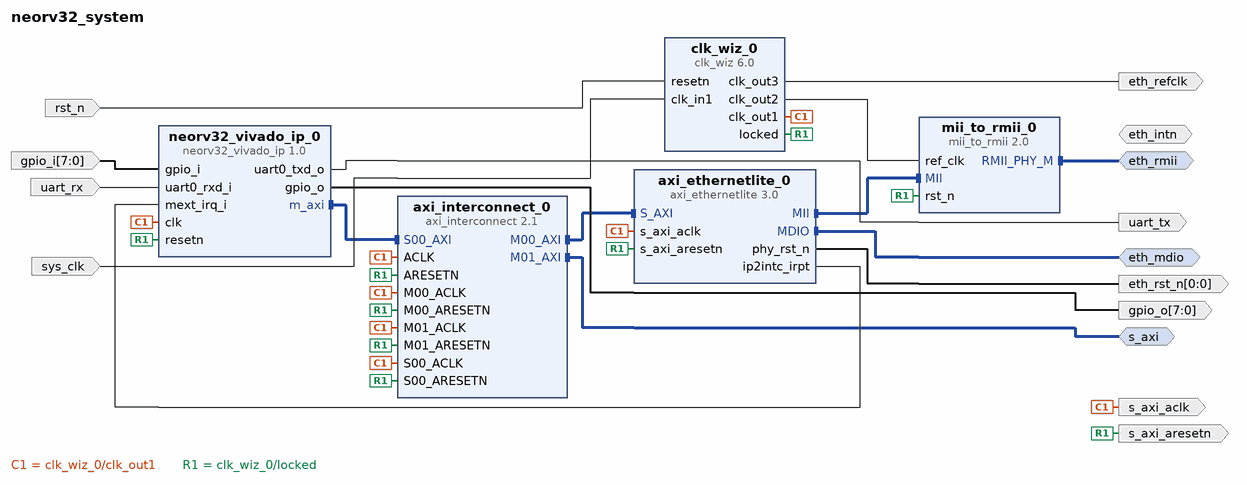
[diagram p0: block diagram of the top level]
# Vivado block design neorv32_system, xc7a100tcsg324-1, Vivado 2024.1
create_bd_design neorv32_system

create_bd_intf_port -mode Master -vlnv xilinx.com:interface:mdio_rtl:1.0 eth_mdio
create_bd_intf_port -mode Master -vlnv xilinx.com:interface:rmii_rtl:1.0 eth_rmii
create_bd_intf_port -mode Master -vlnv xilinx.com:interface:aximm_rtl:1.0 s_axi
set_property -dict [list \
  CONFIG.ADDR_WIDTH 32 \
  CONFIG.DATA_WIDTH 32 \
  CONFIG.HAS_BURST 0 \
  CONFIG.HAS_CACHE 0 \
  CONFIG.HAS_LOCK 0 \
  CONFIG.HAS_QOS 0 \
  CONFIG.HAS_REGION 0 \
  CONFIG.PROTOCOL AXI4LITE \
] [get_bd_intf_ports s_axi]
create_bd_port -dir I -type clk sys_clk
set_property -dict {CONFIG.FREQ_HZ 100000000} [get_bd_ports sys_clk]
create_bd_port -dir I -type rst rst_n
create_bd_port -dir I -from 7 -to 0 gpio_i
create_bd_port -dir O -from 7 -to 0 gpio_o
create_bd_port -dir I uart_rx
create_bd_port -dir O uart_tx
create_bd_port -dir O -from 0 -to 0 eth_rst_n
create_bd_port -dir O -type clk eth_refclk
create_bd_port -dir IO eth_intn
create_bd_port -dir O s_axi_aresetn
create_bd_port -dir O -type clk s_axi_aclk
set_property -dict {CONFIG.ASSOCIATED_BUSIF s_axi} [get_bd_ports s_axi_aclk]

create_bd_cell -type ip -vlnv NEORV32:user:neorv32_vivado_ip:1.0 neorv32_vivado_ip_0
set_property -dict [list \
  CONFIG.IO_CLINT_EN true \
  CONFIG.IO_GPIO_EN true \
  CONFIG.IO_GPIO_IN_NUM 8 \
  CONFIG.IO_GPIO_OUT_NUM 8 \
  CONFIG.IO_UART0_EN true \
  CONFIG.IO_UART0_RX_FIFO 64 \
  CONFIG.IO_UART0_TX_FIFO 64 \
  CONFIG.MEM_INT_DMEM_EN true \
  CONFIG.MEM_INT_DMEM_SIZE 65536 \
  CONFIG.MEM_INT_IMEM_EN true \
  CONFIG.MEM_INT_IMEM_SIZE 65536 \
  CONFIG.OCD_EN false \
  CONFIG.RISCV_ISA_C true \
  CONFIG.RISCV_ISA_E false \
  CONFIG.RISCV_ISA_M true \
  CONFIG.RISCV_ISA_Zaamo true \
  CONFIG.RISCV_ISA_Zalrsc true \
  CONFIG.RISCV_ISA_Zicntr true \
  CONFIG.XBUS_EN true \
  CONFIG.XBUS_REGSTAGE_EN false \
] [get_bd_cells neorv32_vivado_ip_0]
create_bd_cell -type ip -vlnv xilinx.com:ip:clk_wiz:6.0 clk_wiz_0
set_property -dict [list \
  CONFIG.CLKOUT2_JITTER 151.636 \
  CONFIG.CLKOUT2_PHASE_ERROR 98.575 \
  CONFIG.CLKOUT2_REQUESTED_OUT_FREQ 50.000 \
  CONFIG.CLKOUT2_USED true \
  CONFIG.CLKOUT3_JITTER 151.636 \
  CONFIG.CLKOUT3_PHASE_ERROR 98.575 \
  CONFIG.CLKOUT3_REQUESTED_OUT_FREQ 50 \
  CONFIG.CLKOUT3_REQUESTED_PHASE 45 \
  CONFIG.CLKOUT3_USED true \
  CONFIG.MMCM_CLKOUT1_DIVIDE 20 \
  CONFIG.MMCM_CLKOUT2_DIVIDE 20 \
  CONFIG.MMCM_CLKOUT2_PHASE 45.000 \
  CONFIG.NUM_OUT_CLKS 3 \
  CONFIG.RESET_PORT resetn \
  CONFIG.RESET_TYPE ACTIVE_LOW \
  CONFIG.USE_DYN_PHASE_SHIFT false \
] [get_bd_cells clk_wiz_0]
create_bd_cell -type ip -vlnv xilinx.com:ip:axi_ethernetlite:3.0 axi_ethernetlite_0
set_property -dict [list \
  CONFIG.C_INCLUDE_GLOBAL_BUFFERS 1 \
  CONFIG.C_INCLUDE_INTERNAL_LOOPBACK 0 \
  CONFIG.C_INCLUDE_MDIO 1 \
  CONFIG.C_RX_PING_PONG 0 \
  CONFIG.C_TX_PING_PONG 0 \
] [get_bd_cells axi_ethernetlite_0]
create_bd_cell -type ip -vlnv xilinx.com:ip:mii_to_rmii:2.0 mii_to_rmii_0
create_bd_cell -type ip -vlnv xilinx.com:ip:axi_interconnect:2.1 axi_interconnect_0

# ---- connections ----

connect_bd_intf_net [get_bd_intf_ports eth_mdio] [get_bd_intf_pins axi_ethernetlite_0/MDIO]
connect_bd_intf_net [get_bd_intf_pins axi_ethernetlite_0/MII] [get_bd_intf_pins mii_to_rmii_0/MII]
connect_bd_intf_net [get_bd_intf_pins axi_ethernetlite_0/S_AXI] [get_bd_intf_pins axi_interconnect_0/M00_AXI]
connect_bd_intf_net [get_bd_intf_ports s_axi] [get_bd_intf_pins axi_interconnect_0/M01_AXI]
connect_bd_intf_net [get_bd_intf_ports eth_rmii] [get_bd_intf_pins mii_to_rmii_0/RMII_PHY_M]
connect_bd_intf_net [get_bd_intf_pins neorv32_vivado_ip_0/m_axi] [get_bd_intf_pins axi_interconnect_0/S00_AXI]
connect_bd_net [get_bd_pins axi_ethernetlite_0/ip2intc_irpt] [get_bd_pins neorv32_vivado_ip_0/mext_irq_i]
connect_bd_net [get_bd_pins axi_ethernetlite_0/phy_rst_n] [get_bd_ports eth_rst_n]
connect_bd_net [get_bd_pins clk_wiz_0/clk_out1] \
  [get_bd_pins axi_ethernetlite_0/s_axi_aclk] [get_bd_pins neorv32_vivado_ip_0/clk] [get_bd_pins axi_interconnect_0/ACLK] \
  [get_bd_pins axi_interconnect_0/M00_ACLK] [get_bd_pins axi_interconnect_0/M01_ACLK] \
  [get_bd_pins axi_interconnect_0/S00_ACLK] [get_bd_ports s_axi_aclk]
connect_bd_net [get_bd_pins clk_wiz_0/clk_out2] [get_bd_pins mii_to_rmii_0/ref_clk]
connect_bd_net [get_bd_pins clk_wiz_0/clk_out3] [get_bd_ports eth_refclk]
connect_bd_net [get_bd_pins clk_wiz_0/locked] \
  [get_bd_pins axi_ethernetlite_0/s_axi_aresetn] [get_bd_pins neorv32_vivado_ip_0/resetn] \
  [get_bd_pins axi_interconnect_0/M01_ARESETN] [get_bd_pins axi_interconnect_0/M00_ARESETN] \
  [get_bd_pins axi_interconnect_0/S00_ARESETN] [get_bd_pins axi_interconnect_0/ARESETN] [get_bd_pins mii_to_rmii_0/rst_n] \
  [get_bd_ports s_axi_aresetn]
connect_bd_net [get_bd_ports gpio_i] [get_bd_pins neorv32_vivado_ip_0/gpio_i]
connect_bd_net [get_bd_pins neorv32_vivado_ip_0/uart0_txd_o] [get_bd_ports uart_tx]
connect_bd_net -net neorv32_vivado_ip_1_gpio_o [get_bd_pins neorv32_vivado_ip_0/gpio_o] [get_bd_ports gpio_o]
connect_bd_net [get_bd_ports rst_n] [get_bd_pins clk_wiz_0/resetn]
connect_bd_net [get_bd_ports sys_clk] [get_bd_pins clk_wiz_0/clk_in1]
connect_bd_net [get_bd_ports uart_rx] [get_bd_pins neorv32_vivado_ip_0/uart0_rxd_i]

# ---- address map ----
assign_bd_address -offset 0xF0000000 -range 64K -target_address_space [get_bd_addr_spaces neorv32_vivado_ip_0/m_axi] [get_bd_addr_segs axi_ethernetlite_0/S_AXI/Reg]
assign_bd_address -offset 0xF0010000 -range 64K -target_address_space [get_bd_addr_spaces neorv32_vivado_ip_0/m_axi] [get_bd_addr_segs s_axi/Reg]

validate_bd_design
save_bd_design
